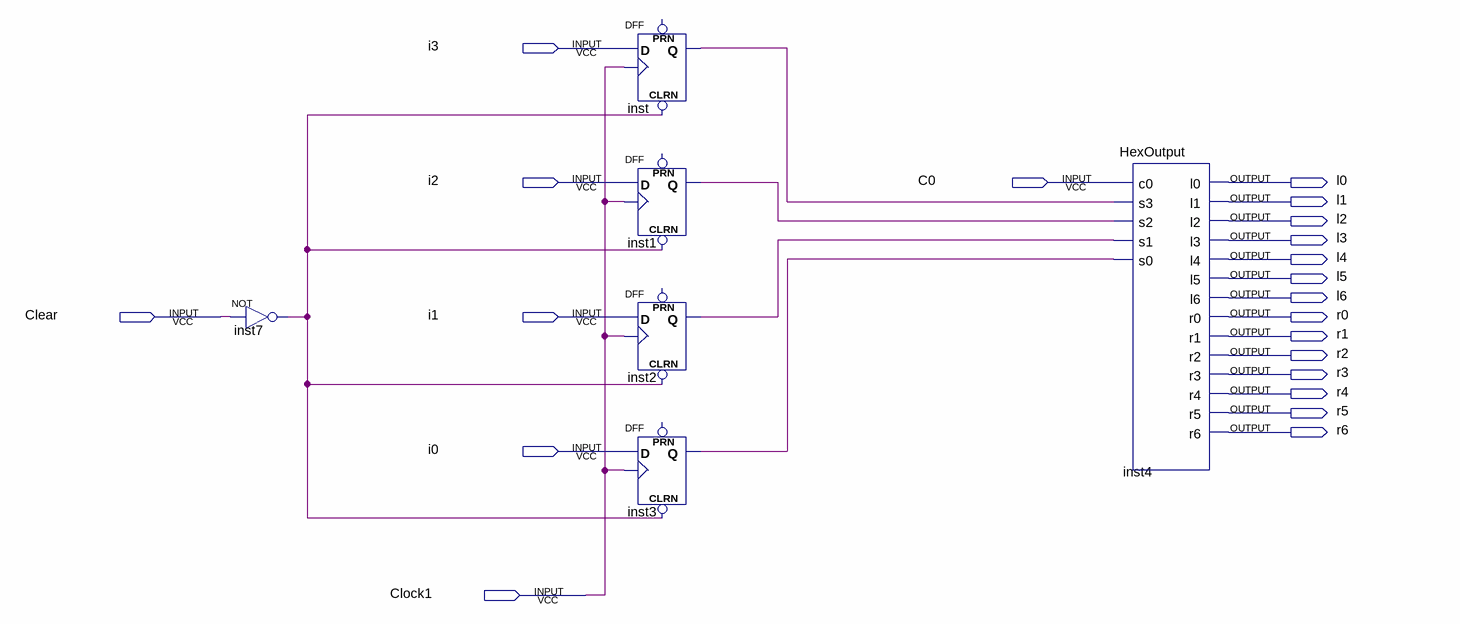
[diagram p0: schematic sheet]
// Quartus schematic Final.bdf as structural Verilog: 6 symbols, 21 pins
module Final (
  input  i3,
  input  i2,
  input  C0,
  input  Clear,
  input  i1,
  input  i0,
  input  Clock1,
  output l0,
  output l1,
  output l2,
  output l3,
  output l4,
  output l5,
  output l6,
  output r0,
  output r1,
  output r2,
  output r3,
  output r4,
  output r5,
  output r6
);

  wire inst1_q, inst2_q, inst3_q, inst7_out, inst_q;

  not inst7 (inst7_out, Clear);
  DFF inst (.CLRN(inst7_out), .CLK(Clock1), .D(i3), .Q(inst_q));  // open: PRN
  DFF inst1 (.CLRN(inst7_out), .CLK(Clock1), .D(i2), .Q(inst1_q));  // open: PRN
  DFF inst2 (.CLRN(inst7_out), .CLK(Clock1), .D(i1), .Q(inst2_q));  // open: PRN
  DFF inst3 (.CLRN(inst7_out), .CLK(Clock1), .D(i0), .Q(inst3_q));  // open: PRN
  HexOutput inst4 (
    .c0(C0), .s3(inst_q), .s2(inst1_q), .s1(inst2_q), .s0(inst3_q), .l0(l0), .l1(l1), .l2(l2), .l3(l3),
    .l4(l4), .l5(l5), .l6(l6), .r0(r0), .r1(r1), .r2(r2), .r3(r3), .r4(r4), .r5(r5), .r6(r6));
endmodule
